# Altium schematic sheet LEDs.SchDoc
size A; SheetNumber: 1; SheetTotal: 4
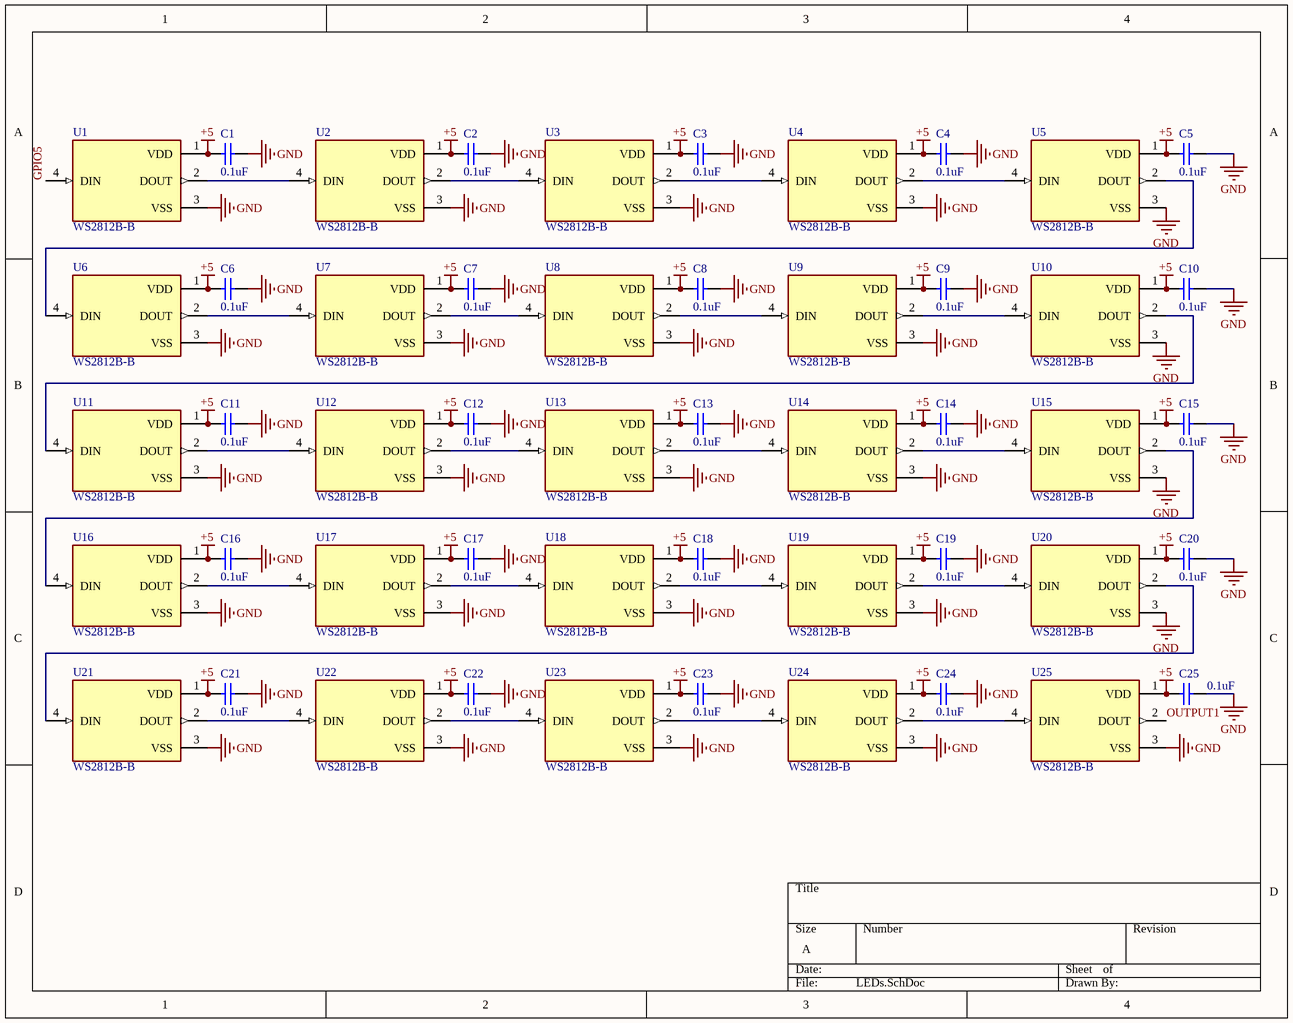
[diagram p0: LEDs.SchDoc]

## Parts
C1  0.1uF  [CAPC3413X12N]
C2  0.1uF  [CAPC3413X12N]
C3  0.1uF  [CAPC3413X12N]
C4  0.1uF  [CAPC3413X12N]
C5  0.1uF  [CAPC3413X12N]
C6  0.1uF  [CAPC3413X12N]
C7  0.1uF  [CAPC3413X12N]
C8  0.1uF  [CAPC3413X12N]
C9  0.1uF  [CAPC3413X12N]
C10  0.1uF  [CAPC3413X12N]
C11  0.1uF  [CAPC3413X12N]
C12  0.1uF  [CAPC3413X12N]
C13  0.1uF  [CAPC3413X12N]
C14  0.1uF  [CAPC3413X12N]
C15  0.1uF  [CAPC3413X12N]
C16  0.1uF  [CAPC3413X12N]
C17  0.1uF  [CAPC3413X12N]
C18  0.1uF  [CAPC3413X12N]
C19  0.1uF  [CAPC3413X12N]
C20  0.1uF  [CAPC3413X12N]
C21  0.1uF  [CAPC3413X12N]
C22  0.1uF  [CAPC3413X12N]
C23  0.1uF  [CAPC3413X12N]
C24  0.1uF  [CAPC3413X12N]
C25  0.1uF  [CAPC3413X12N]
U1  WS2812B-B  [LED_WS2812B-B]
U2  WS2812B-B  [LED_WS2812B-B]
U3  WS2812B-B  [LED_WS2812B-B]
U4  WS2812B-B  [LED_WS2812B-B]
U5  WS2812B-B  [LED_WS2812B-B]
U6  WS2812B-B  [LED_WS2812B-B]
U7  WS2812B-B  [LED_WS2812B-B]
U8  WS2812B-B  [LED_WS2812B-B]
U9  WS2812B-B  [LED_WS2812B-B]
U10  WS2812B-B  [LED_WS2812B-B]
U11  WS2812B-B  [LED_WS2812B-B]
U12  WS2812B-B  [LED_WS2812B-B]
U13  WS2812B-B  [LED_WS2812B-B]
U14  WS2812B-B  [LED_WS2812B-B]
U15  WS2812B-B  [LED_WS2812B-B]
U16  WS2812B-B  [LED_WS2812B-B]
U17  WS2812B-B  [LED_WS2812B-B]
U18  WS2812B-B  [LED_WS2812B-B]
U19  WS2812B-B  [LED_WS2812B-B]
U20  WS2812B-B  [LED_WS2812B-B]
U21  WS2812B-B  [LED_WS2812B-B]
U22  WS2812B-B  [LED_WS2812B-B]
U23  WS2812B-B  [LED_WS2812B-B]
U24  WS2812B-B  [LED_WS2812B-B]
U25  WS2812B-B  [LED_WS2812B-B]

## Nets
+5: C1.1 C2.1 C3.1 C4.1 C5.1 C6.1 C7.1 C8.1 C9.1 C10.1 C11.1 C12.1 C13.1 C14.1 C15.1 C16.1 C17.1 C18.1 C19.1 C20.1 C21.1 C22.1 C23.1 C24.1 C25.1 U1.1(VDD) U2.1(VDD) U3.1(VDD) U4.1(VDD) U5.1(VDD) U6.1(VDD) U7.1(VDD) U8.1(VDD) U9.1(VDD) U10.1(VDD) U11.1(VDD) U12.1(VDD) U13.1(VDD) U14.1(VDD) U15.1(VDD) U16.1(VDD) U17.1(VDD) U18.1(VDD) U19.1(VDD) U20.1(VDD) U21.1(VDD) U22.1(VDD) U23.1(VDD) U24.1(VDD) U25.1(VDD)
GND: C1.2 C2.2 C3.2 C4.2 C5.2 C6.2 C7.2 C8.2 C9.2 C10.2 C11.2 C12.2 C13.2 C14.2 C15.2 C16.2 C17.2 C18.2 C19.2 C20.2 C21.2 C22.2 C23.2 C24.2 C25.2 U1.3(VSS) U2.3(VSS) U3.3(VSS) U4.3(VSS) U5.3(VSS) U6.3(VSS) U7.3(VSS) U8.3(VSS) U9.3(VSS) U10.3(VSS) U11.3(VSS) U12.3(VSS) U13.3(VSS) U14.3(VSS) U15.3(VSS) U16.3(VSS) U17.3(VSS) U18.3(VSS) U19.3(VSS) U20.3(VSS) U21.3(VSS) U22.3(VSS) U23.3(VSS) U24.3(VSS) U25.3(VSS)
GPIO5: U1.4(DIN)
OUTPUT1: U25.2(DOUT)
NetU1_2: U1.2(DOUT) U2.4(DIN)
NetU2_2: U2.2(DOUT) U3.4(DIN)
NetU3_2: U3.2(DOUT) U4.4(DIN)
NetU4_2: U4.2(DOUT) U5.4(DIN)
NetU5_2: U5.2(DOUT) U6.4(DIN)
NetU6_2: U6.2(DOUT) U7.4(DIN)
NetU7_2: U7.2(DOUT) U8.4(DIN)
NetU8_2: U8.2(DOUT) U9.4(DIN)
NetU9_2: U9.2(DOUT) U10.4(DIN)
NetU10_2: U10.2(DOUT) U11.4(DIN)
NetU11_2: U11.2(DOUT) U12.4(DIN)
NetU12_2: U12.2(DOUT) U13.4(DIN)
NetU13_2: U13.2(DOUT) U14.4(DIN)
NetU14_2: U14.2(DOUT) U15.4(DIN)
NetU15_2: U15.2(DOUT) U16.4(DIN)
NetU16_2: U16.2(DOUT) U17.4(DIN)
NetU17_2: U17.2(DOUT) U18.4(DIN)
NetU18_2: U18.2(DOUT) U19.4(DIN)
NetU19_2: U19.2(DOUT) U20.4(DIN)
NetU20_2: U20.2(DOUT) U21.4(DIN)
NetU21_2: U21.2(DOUT) U22.4(DIN)
NetU22_2: U22.2(DOUT) U23.4(DIN)
NetU23_2: U23.2(DOUT) U24.4(DIN)
NetU24_2: U24.2(DOUT) U25.4(DIN)

## Library data of the parts
C1-C25 = CAP SMD 0805: CAP 0805; Designer: Abbas Basereh; Desc.: CAP SMD 0805; Data: 16-12-2016
U1-U25 = WS2812B-B: Intelligent control LED integrated light source; MF: Worldsemi; SnapEDA_Link: https://www.snapeda.com/parts/WS2812B-B/Worldsemi/view-part/5799638/?ref=snap; Package: Package; Check_prices: https://www.snapeda.com/parts/WS2812B-B/Worldsemi/view-part/5799638/?ref=eda; Availability: Unavailable; Price: None; MP: WS2812B-B; Value: *